# EAGLE design fresh_air_control (EAGLE 9.6.2)
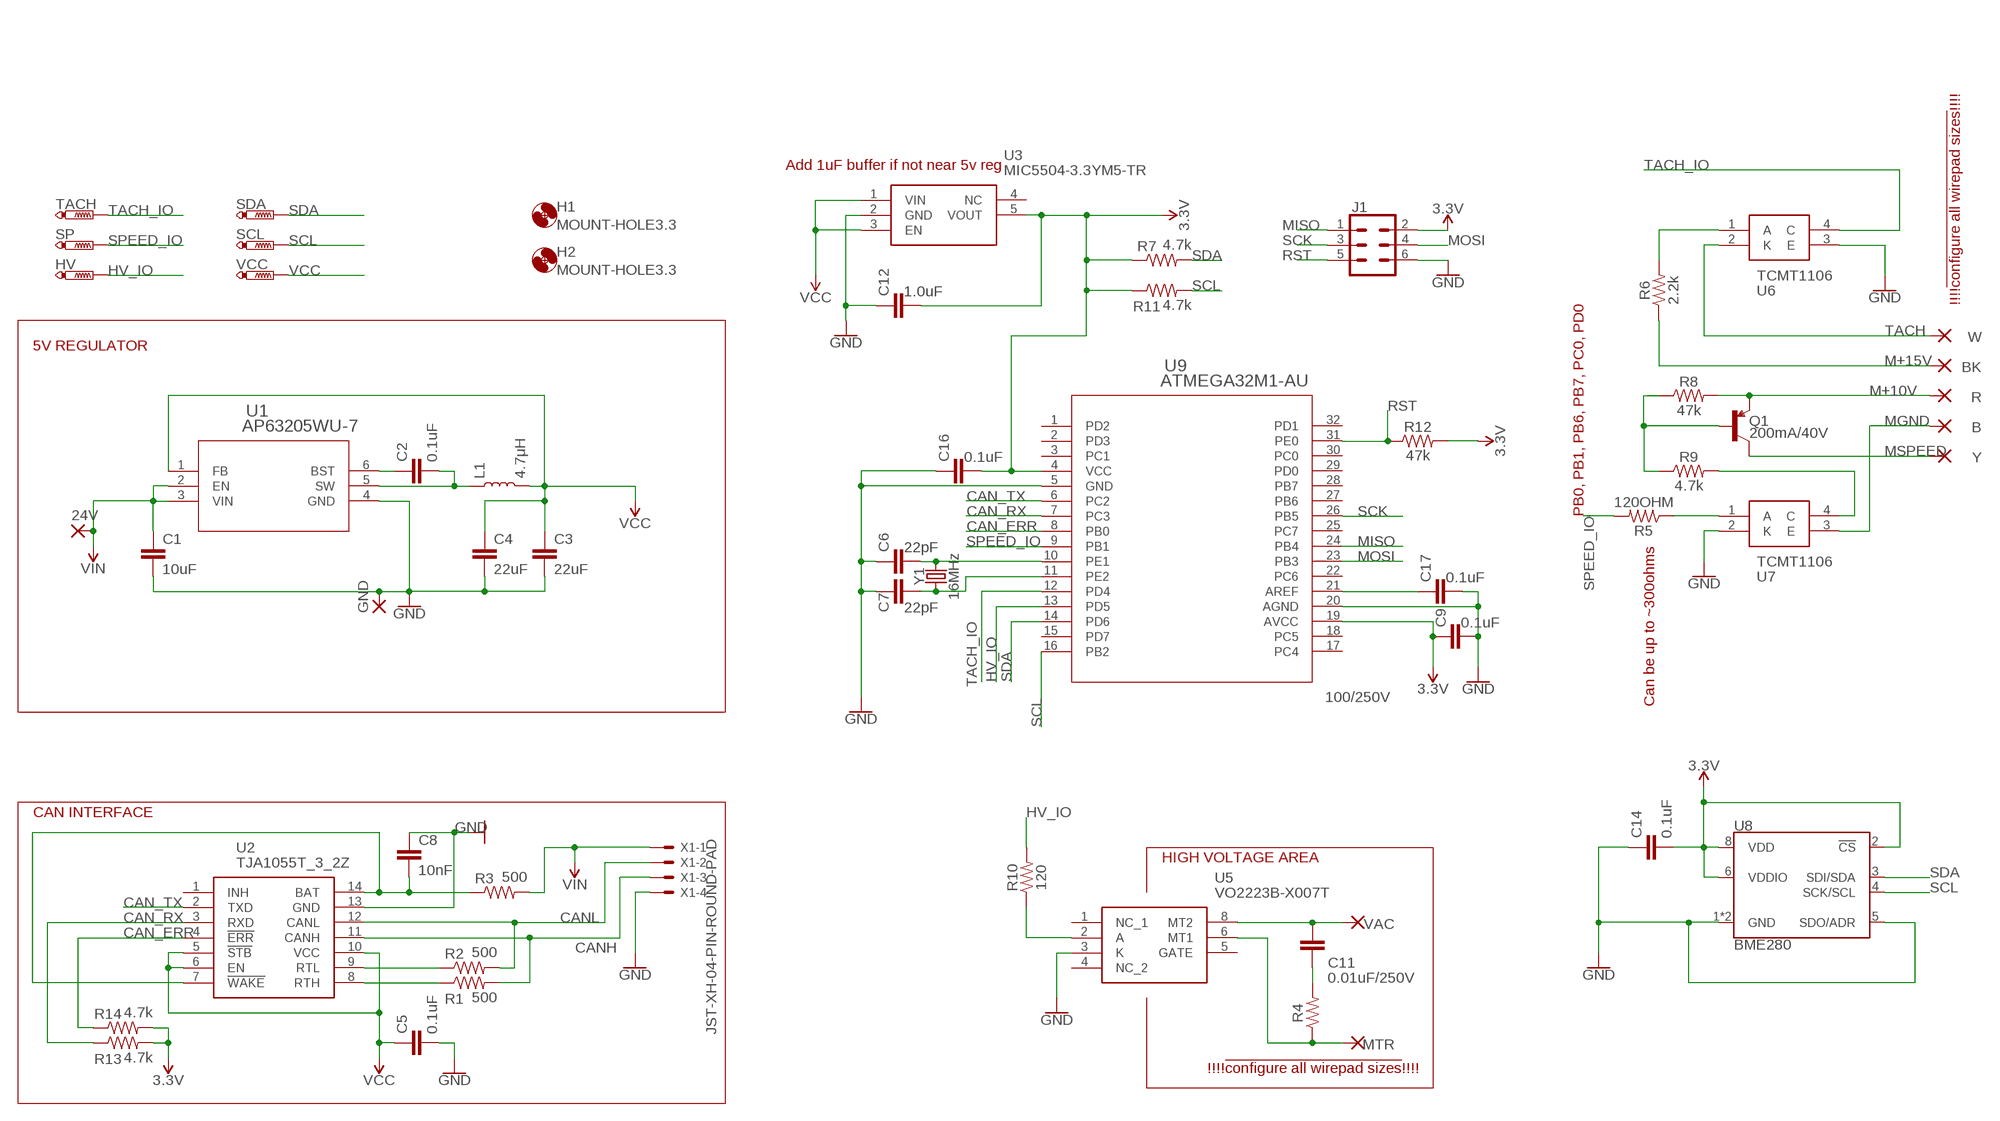
[diagram p0: schematic, sheet 1]

## Parts
24V  2,15/1,0  [2,15/1,0]
B  1,6/0,8  [1,6/0,8]
BK  1,6/0,8  [1,6/0,8]
C1  10uF  10UF-1210-50V-20%  [1210]
C2  0.1uF  0.1UF-0603-25V-5%  [0603]
C3  22uF  22UF-0805-6.3V-20%  [0805]
C4  22uF  22UF-0805-6.3V-20%  [0805]
C5  0.1uF  0.1UF-0603-25V-5%  [0603]
C6  22pF  22PF-0603-50V-5%  [0603]
C7  22pF  22PF-0603-50V-5%  [0603]
C8  10nF  10NF-0603-50V-10%  [0603]
C9  0.1uF  0.1UF-0603-25V-5%  [0603]
C11  0.01uF/250V  CAP-0805  [0805]
C12  1.0uF  1.0UF-0603-16V-10%  [0603]
C14  0.1uF  0.1UF-0603-25V-5%  [0603]
C16  0.1uF  0.1UF-0603-25V-5%  [0603]
C17  0.1uF  0.1UF-0603-25V-5%  [0603]
GND  2,15/1,0  [2,15/1,0]
H1  MOUNT-HOLE3.3  [3,3]
H2  MOUNT-HOLE3.3  [3,3]
HV  PTR1B1,27  [B1,27]
J1  CONN_03X2NO_SILK  [2X3-NS]
L1  4.7μH  4.7μH_SHIELDED_INDUCTORNPIS_LS  [INDUCTOR_4X4MM]
MTR  1,6/0,8  [1,6/0,8]
Q1  200mA/40V  TRANS_PNP-PMBT3906|MMBT3906L  [SOT23-3]
R  1,6/0,8  [1,6/0,8]
R1  500  RESISTOR0603  [0603]
R2  500  RESISTOR0603  [0603]
R3  500  RESISTOR0603  [0603]
R4  100/250V  RESISTOR0805  [0805]
R5  120OHM  [0603]
R6  2.2k  2.2KOHM-0603-1/10W-1%  [0603]
R7  4.7k  4.7KOHM-0603-1/10W-1%  [0603]
R8  47k  47KOHM-0603-1/10W-1%  [0603]
R9  4.7k  4.7KOHM-0603-1/10W-1%  [0603]
R10  120  120OHM  [0603]
R11  4.7k  4.7KOHM-0603-1/10W-1%  [0603]
R12  47k  47KOHM-0603-1/10W-1%  [0603]
R13  4.7k  4.7KOHM-0603-1/10W-1%  [0603]
R14  4.7k  4.7KOHM-0603-1/10W-1%  [0603]
SCL  PTR1B1,27  [B1,27]
SDA  PTR1B1,27  [B1,27]
SP  PTR1B1,27  [B1,27]
TACH  PTR1B1,27  [B1,27]
U1  AP63205WU-7  [SOIC_05WU-7_DIO]
U2  TJA1055T_3_2Z  [SOIC127P600X175-14N]
U3  MIC5504-3.3YM5-TR  [SOT95P280X145-5N]
U5  VO2223B-X007T  [VO2223BX007T]
U6  TCMT1106  [SOIC127P700X230-4N]
U7  TCMT1106  [SOIC127P700X230-4N]
U8  BME280  [LGA-8-2.5X2.5]
U9  ATMEGA32M1-AU  [32A_ATM]
VAC  1,6/0,8  [1,6/0,8]
VCC  PTR1B1,27  [B1,27]
W  1,6/0,8  [1,6/0,8]
X1  JST-XH-04-PIN-ROUND-PAD  [JST-XH-04-PACKAGE-ROUND-PAD]
Y  1,6/0,8  [1,6/0,8]
Y1  16MHz  CRYSTAL-16MHZSMD-5X3.2  [CRYSTAL-SMD-5X3.2-4PAD]

## Nets
3.3V: C9.1 C12.2 C14.2 C16.2 J1.2 R7.1 R11.1 R12.2 R13.2 R14.2 U3.5(VOUT) U8.2(!CS) U8.6(VDDIO) U8.8(VDD) U9.4(VCC) U9.19(AVCC)
CAN_ERR: R14.1 U2.4(!ERR) U9.8(PB0)
CAN_RX: R13.1 U2.3(RXD) U9.7(PC3)
CAN_TX: U2.2(TXD) U9.6(PC2)
CANH: R1.2 U2.11(CANH) X1.3
CANL: R2.2 U2.12(CANL) X1.2
GND: C1.2 C3.2 C4.2 C5.2 C6.1 C7.1 C8.1 C9.2 C12.1 C14.1 C16.1 C17.2 GND.1(P) J1.6 U1.4(GND) U2.13(GND) U3.2(GND) U5.3(K) U6.3(E) U7.2(K) U8.1(GND) U8.5(SDO/ADR) U8.7(GND) U9.5(GND) U9.20(AGND) X1.4
HV_IO: HV.TP R10.2 U9.13(PD5)
LINE: C11.1 U5.8(MT2) VAC.1(P)
LOAD: MTR.1(P) R4.1 U5.6(MT1)
M+10V: Q1.2(E) R8.2 R.1(P)
M+15V: BK.1(P) R6.1
MGND: B.1(P) U7.3(E)
MISO: J1.1 U9.24(PB4)
MOSI: J1.4 U9.23(PB3)
MSPEED: Q1.3(C) Y.1(P)
N$1: C2.2 L1.P$1 U1.5(SW)
N$2: C2.1 U1.6(BST)
N$3: C6.2 U9.10(PE1) Y1.3
N$4: C7.2 U9.11(PE2) Y1.1
N$5: R2.1 U2.9(RTL)
N$6: R1.1 U2.8(RTH)
N$8: C8.2 R3.1 U2.7(!WAKE) U2.14(BAT)
N$10: R6.2 U6.1(A)
N$11: C11.2 R4.2
N$12: R10.1 U5.2(A)
N$13: R5.1 U7.1(A)
N$15: Q1.1(B) R8.1 R9.1
N$16: R9.2 U7.4(C)
N$20: C17.1 U9.21(AREF)
RST: J1.5 R12.1 U9.31(PE0)
SCK: J1.3 U9.26(PB5)
SCL: R11.2 SCL.TP U8.4(SCK/SCL) U9.16(PB2)
SDA: R7.2 SDA.TP U8.3(SDI/SDA) U9.14(PD6)
SPEED_IO: R5.2 SP.TP U9.9(PB1)
TACH: U6.2(K) W.1(P)
TACH_IO: TACH.TP U6.4(C) U9.12(PD4)
VCC: C3.1 C4.1 C5.1 L1.P$2 U1.1(FB) U2.5(!STB) U2.6(EN) U2.10(VCC) U3.1(VIN) U3.3(EN) VCC.TP
VIN: 24V.1(P) C1.1 R3.2 U1.2(EN) U1.3(VIN) X1.1
Unconnected: U2.1(INH) U3.4(NC) U5.1(NC_1) U5.4(NC_2) U5.5(GATE) U9.1(PD2) U9.2(PD3) U9.3(PC1) U9.15(PD7) U9.17(PC4) U9.18(PC5) U9.22(PC6) U9.25(PC7) U9.27(PB6) U9.28(PB7) U9.29(PD0) U9.30(PC0) U9.32(PD1)

## Notes on the sheet
- Add 1uF buffer if not near 5v reg
- !!!!!configure all wirepad sizes!!!!!
- 5V REGULATOR
- PB0, PB1, PB6, PB7, PC0, PD0
- Can be up to ~300ohms
- CAN INTERFACE
- HIGH VOLTAGE AREA
- !!!!!configure all wirepad sizes!!!!!

## Library data of the parts
24V GND = wirepad:2,15/1,0: THROUGH-HOLE PAD
B BK MTR R VAC W Y = wirepad:1,6/0,8: THROUGH-HOLE PAD
C1 = SparkFun-Capacitors:10UF: 10.0µF ceramic capacitors A capacitor is a passive two-terminal electrical component used to store electrical energy temporarily in an electric field.; PROD_ID: CAP-09824
C2 C5 C9 C14 C16 C17 = SparkFun-Capacitors:0.1UF: 0.1µF ceramic capacitors A capacitor is a passive two-terminal electrical component used to store electrical energy temporarily in an electric field.; PROD_ID: CAP-08604
C3 C4 = SparkFun-Capacitors:22UF: 22µF ceramic capacitors A capacitor is a passive two-terminal electrical component used to store electrical energy temporarily in an electric field.; PROD_ID: CAP-08402
C6 C7 = SparkFun-Capacitors:22PF: 22pF ceramic capacitors A capacitor is a passive two-terminal electrical component used to store electrical energy temporarily in an electric field.; PROD_ID: CAP-07876
C8 = SparkFun-Capacitors:10NF: 0.01uF/10nF/10,000pF ceramic capacitors A capacitor is a passive two-terminal electrical component used to store electrical energy temporarily in an electric field. CAP-09321; PROD_ID: CAP-00867
C11 = SparkFun-Capacitors:CAP
C12 = SparkFun-Capacitors:1.0UF: 1µF ceramic capacitors A capacitor is a passive two-terminal electrical component used to store electrical energy temporarily in an electric field.; PROD_ID: CAP-00868
H1 H2 = holes:MOUNT-HOLE: MOUNTING HOLE with drill center marker
HV SCL SDA SP TACH VCC = testpad:PTR1: TEST PIN
J1 = SparkFun-Connectors:CONN_03X2: Multi connection point. Often used as Generic Header-pin footprint for 0.1 inch spaced/style header connections You can populate with any combo of single row headers, but if you'd like an exact match, check these: Header - 2x3 (Male, 0.1") <https://www.sparkfun.com/products/12807> (PRT-12807) Header - 2x3 (Female, 0.1") <https://www.sparkfun.com/products/13010> (PRT-13010) 2x3 Pin Shrouded Header <https://www.sparkfun.com/products/10877> (PRT-10877) On any of the 0.1 inch spaced packages, you can populate with these: Break Away Headers - Straight <https://www.sparkfun.com/products/116> (PRT-00116) Break Away Male Headers - Right Angle <https://www.sparkfun.com/products/553> (PRT-00553) Female Headers <https://www.sparkfun.com/products/115> (PRT-00115) Break Away Headers - Machine Pin <https://www.sparkfun.com/products/117> (PRT-00117) Break Away Female Headers - Swiss Machine Pin <https://www.sparkfun.com/products/743> (PRT-00743) Special note: the shrouded connector mates well with our 3x2 ribbon cables: Ribbon Crimp Connector - 6-pin (2x3, Female) <https://www.sparkfun.com/products/10651> (PRT-10651) Ribbon Cable - 6 wire (15ft) <https://www.sparkfun.com/products/10646> (PRT-10646)
L1 = SparkFun-Coils:4.7μH_SHIELDED_INDUCTOR: 4.7uH Inductor 4.7uH 1.4A 50mOhm 1008(2520) Package Shielded; PROD_ID: NDUC-15245
Q1 = SparkFun-DiscreteSemi:TRANS_PNP: PNP transistor Current controlled devices typically used to amplify current or used as a switch. SparkFun Products: SparkFun Serial Enabled 16x2 LCD - Red on Black <https://www.sparkfun.com/products/9068> SparkFun Logomatic <https://www.sparkfun.com/products/12772>; PROD_ID: TRANS-08052
R1-R4 = SparkFun-Resistors:RESISTOR: Generic Resistor Package
R5 R10 = SparkFun-Resistors:120OHM: 120Ω resistor A resistor is a passive two-terminal electrical component that implements electrical resistance as a circuit element. Resistors act to reduce current flow, and, at the same time, act to lower voltage levels within circuits. - Wikipedia
R6 = SparkFun-Resistors:2.2KOHM: 2.2kΩ resistor A resistor is a passive two-terminal electrical component that implements electrical resistance as a circuit element. Resistors act to reduce current flow, and, at the same time, act to lower voltage levels within circuits. - Wikipedia; PROD_ID: RES-08272
R7 R9 R11 R13 R14 = SparkFun-Resistors:4.7KOHM: 4.7kΩ resistor A resistor is a passive two-terminal electrical component that implements electrical resistance as a circuit element. Resistors act to reduce current flow, and, at the same time, act to lower voltage levels within circuits. - Wikipedia; PROD_ID: RES-07857
R8 R12 = SparkFun-Resistors:47KOHM: 47kΩ resistor A resistor is a passive two-terminal electrical component that implements electrical resistance as a circuit element. Resistors act to reduce current flow, and, at the same time, act to lower voltage levels within circuits. - Wikipedia; PROD_ID: RES-07871
U1 = Diodes buck converter:AP63205WU-7; COPYRIGHT: Copyright (C) 2023 Ultra Librarian. All rights reserved.; MANUFACTURER_PART_NUMBER: AP63205WU-7; MFR_NAME: Diodes Inc
U2 = TJA1055T_3_2Z:TJA1055T_3_2Z: CAN Interface IC Enhanced fault-tolerant CAN transceiver Source: Datasheet <http://www.nxp.com/docs/en/data-sheet/TJA1055.pdf>; DESCRIPTION: CAN Interface IC Enhanced fault-tolerant CAN transceiver; HEIGHT: 1.75mm; MANUFACTURER_NAME: NXP; MANUFACTURER_PART_NUMBER: TJA1055T/3/2Z; MOUSER_PART_NUMBER: 771-TJA1055T/3/2Z; MOUSER_PRICE-STOCK: https://www.mouser.co.uk/ProductDetail/NXP-Semiconductors/TJA1055T-3-2Z?qs=qSfuJ%252Bfl%2Fd73Y%2FIsMw3Ayg%3D%3D
U3 = MIC5504-3.3YM5-TR:MIC5504-3.3YM5-TR: MICROCHIP - MIC5504-3.3YM5-TR - LDO VOLT REG, 0.3A, 3.3V, SOT-23-5 Source: Datasheet <https://componentsearchengine.com/Datasheets/2/MIC5504-3.3YM5-TR.pdf>; DESCRIPTION: MICROCHIP - MIC5504-3.3YM5-TR - LDO VOLT REG, 0.3A, 3.3V, SOT-23-5; HEIGHT: 1.45mm; MANUFACTURER_NAME: Microchip; MANUFACTURER_PART_NUMBER: MIC5504-3.3YM5-TR; MOUSER_PART_NUMBER: 998-MIC5504-3.3YM5TR; MOUSER_PRICE-STOCK: https://www.mouser.co.uk/ProductDetail/Microchip-Technology/MIC5504-3.3YM5-TR?qs=U6T8BxXiZAUmVQ5Zs217qQ%3D%3D
U5 = VO2223B-X007T:VO2223B-X007T: Triac & SCR Output Optocouplers 1A, 600V PhotoTRIAC SMD-8, UL, cUL Source: Datasheet <https://www.vishay.com/docs/83312/vo2223b.pdf>; DESCRIPTION: Triac & SCR Output Optocouplers 1A, 600V PhotoTRIAC SMD-8, UL, cUL; HEIGHT: 4.6mm; MANUFACTURER_NAME: Vishay; MANUFACTURER_PART_NUMBER: VO2223B-X007T; MOUSER_PART_NUMBER: 78-VO2223B-X007T; MOUSER_PRICE-STOCK: https://www.mouser.co.uk/ProductDetail/Vishay-Semiconductors/VO2223B-X007T?qs=r5DSvlrkXmLdAybzHjTr7g%3D%3D
U6 U7 = TCMT1106:TCMT1106: Optocoupler Transistor O/P 1-CH Source: Datasheet <https://www.vishay.com/docs/83510/tcmt1100.pdf>; DESCRIPTION: Optocoupler Transistor O/P 1-CH; HEIGHT: 2.3mm; MANUFACTURER_NAME: Vishay; MANUFACTURER_PART_NUMBER: TCMT1106; MOUSER_PART_NUMBER: 782-TCMT1106; MOUSER_PRICE-STOCK: https://www.mouser.co.uk/ProductDetail/Vishay-Semiconductors/TCMT1106?qs=iFB%2FIts7N%252BA3ecLP71cKjQ%3D%3D
U8 = SparkFun-Sensors:BME280: Bosch BME280 – Combined Humidity and Pressure Sensor The BME280 is as combined digital humidity, pressure and temperature sensor based on proven sensing principles. The sensor module is housed in an extremely compact metal-lid LGA package with a footprint of only 2.5×2.5mm² with a height of 0.93mm. Its small dimensions and its low power consumption allow the implementation in battery driven devices such as handsets, GPS modules or watches. Datasheet <https://cdn.sparkfun.com/assets/learn_tutorials/4/1/9/BST-BME280_DS001-10.pdf> SparkFun Products SparkFun Atmospheric Sensor Breakout - BME280 <https://www.sparkfun.com/products/13676> (SEN-13676); PROD_ID: IC-13090
U9 = ATMEGA31M1-AU:ATMEGA32M1-AU; COPYRIGHT: Copyright (C) 2023 Ultra Librarian. All rights reserved.; MANUFACTURER_PART_NUMBER: ATMEGA32M1-AU; MFR_NAME: Microchip
X1 = Rembrandt Electronics - JST XH Connectors v1-0:JST-XH-04-PIN: JST XH Connector 2 Pin Wire to board connector. Pitch: 2,54 mm, (0.100") Number of pins: 4 Created by Rembrandt Electronics www.rembrandtelectronics.com
Y1 = SparkFun-Clocks:CRYSTAL-16MHZ: 16MHz Crystal Digikey Example <http://www.digikey.com/product-search/en?keywords=535-9122-1-ND> Frequency: 16MHz Frequency Stability: ±50ppm Frequency Tolerance: ±20ppm Load Capacitance: 18pF SparkFun Products: Pro Micro -5V/16MHz <https://www.sparkfun.com/products/12640> SparkFun Serial Enabled LCD Kit <https://www.sparkfun.com/products/10097>; PROD_ID: XTAL-08218; SF_ID: COM-00094

## Board
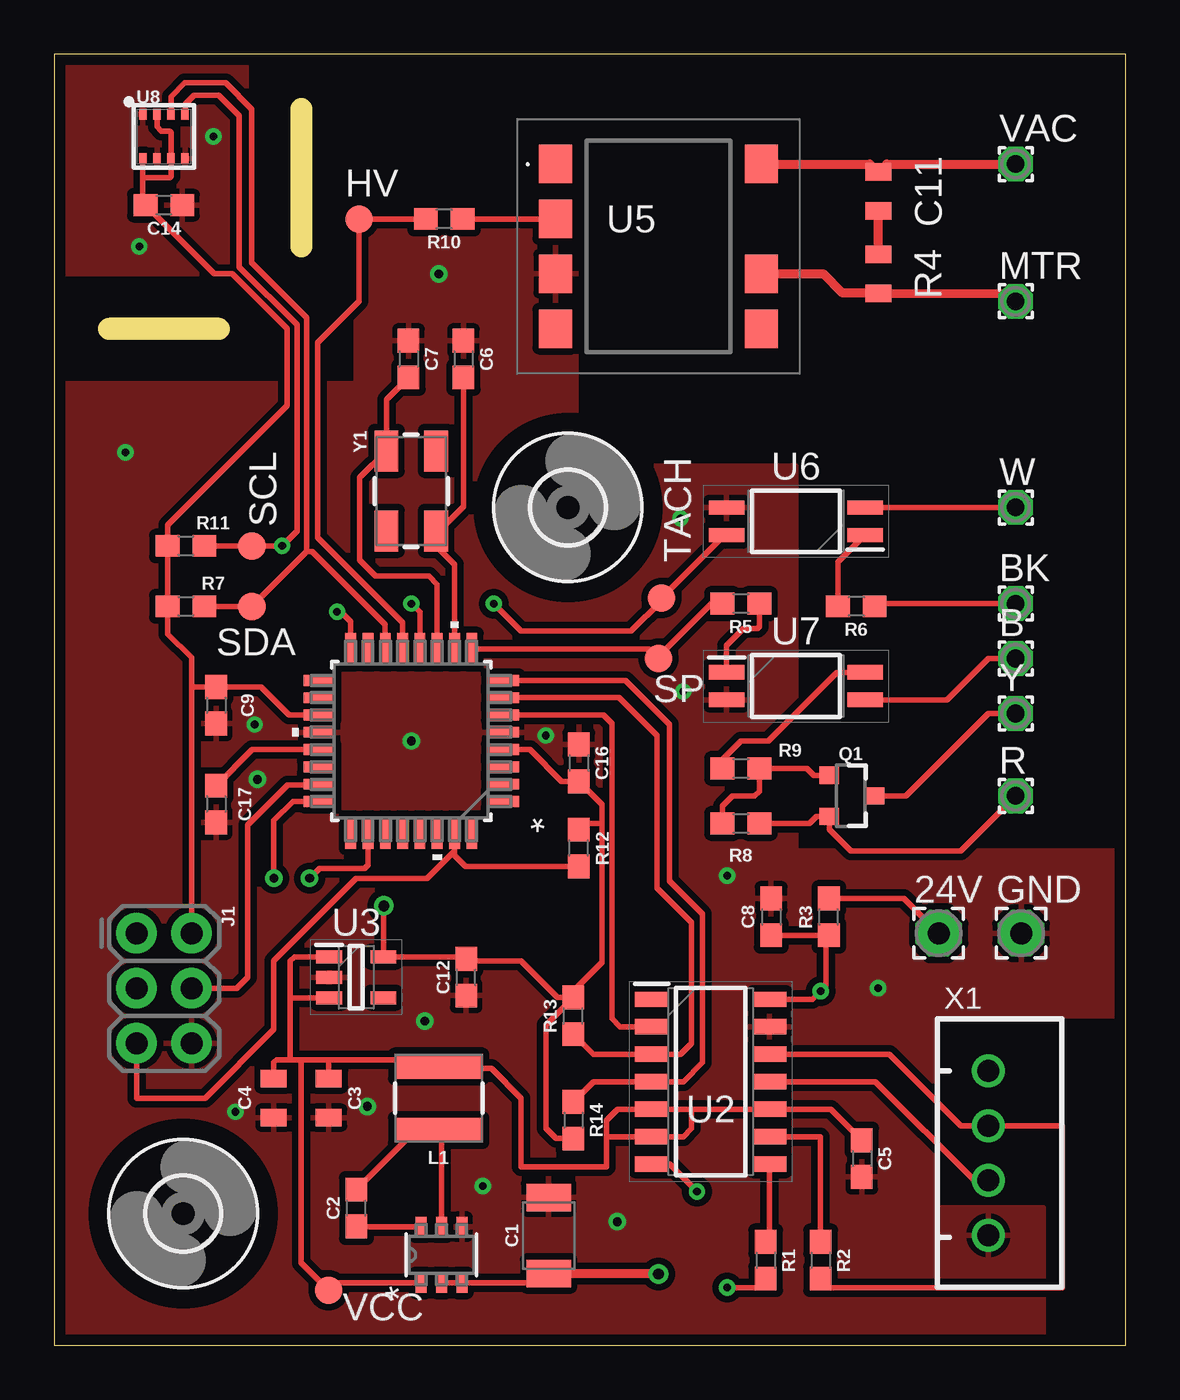
[diagram p1: board, top side]
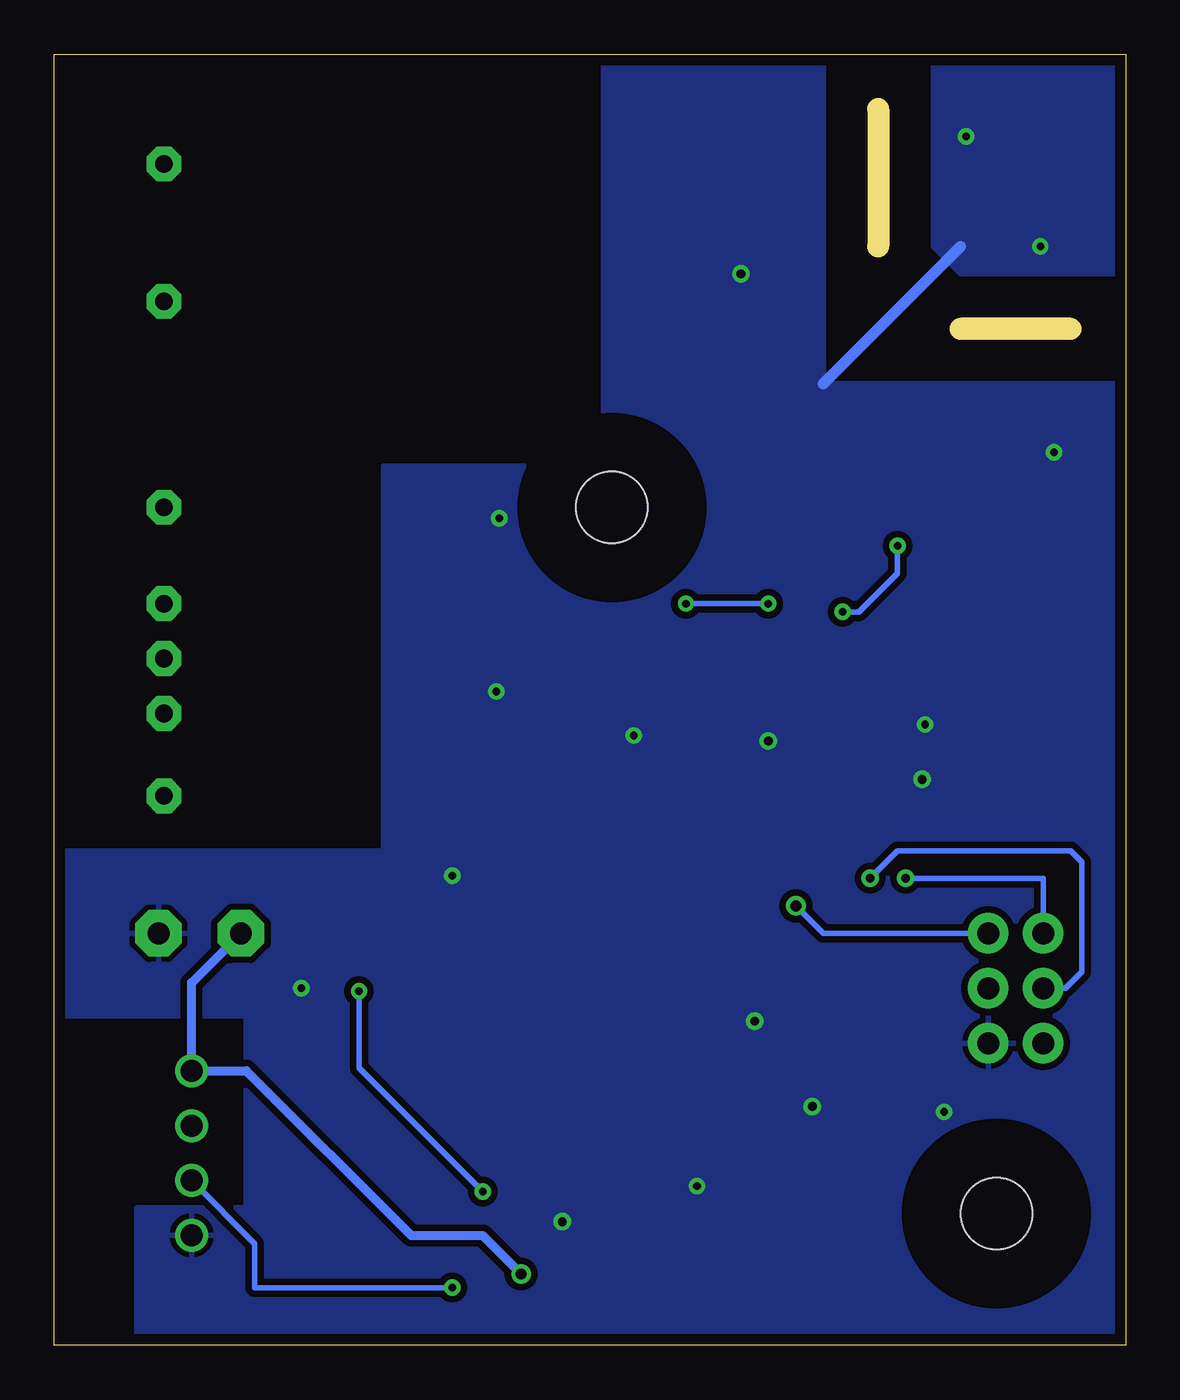
[diagram p2: board, bottom side, seen from below]

Size 49.53 x 59.69 mm. Coordinates in mm from the lower left corner, seen from the top.
Outline: 2.54,46.99 7.62,46.99
Outline: 11.43,57.15 11.43,50.8
Outline: 0,0 49.53,0 49.53,59.69 0,59.69 0,0
Copper layers (1*16): Top 0.035mm / dielectric 1.6mm / Bottom 0.035mm
Design rules "Elecrow_2-layer_PCB_eagle_rule_conservative": minimum track width 8mil, minimum drill 12mil, track to track 8mil, track to pad 6mil, pad to pad 6mil, via to via 8mil, smd to smd 0mil, copper to edge 20mil, drill to drill 10mil, minimum pad ring 8mil, minimum via ring 8mil, stop-mask expansion 0mil, vias tented up to drill 100mil, thermal gap 10mil
Milling: 2 lines

### Footprints (pad centres in the part's own frame; a part is rotated, then mirrored left to right if it is on the bottom)
2,15/1,0 = drill 1.016 pad 2.159 octagon: 1 0,0
1,6/0,8 = drill 0.813 pad 1.6 octagon: 1 0,0
1210 = smd 1.27 x 2.06: 1 -1.755,0; 2 1.755,0
0603 = smd 1.1 x 1: 1 -0.85,0; 2 0.85,0
0805 = smd 0.8 x 1.2: 1 -0.9,0; 2 0.9,0
3,3 = hole 3.3: 0,0
B1,27 = smd 1.27 x 1.27: TP 0,0
2X3-NS = drill 1.016 pad 1.88: 1 -2.54,-1.27; 2 -2.54,1.27; 3 0,-1.27; 4 0,1.27; 5 2.54,-1.27; 6 2.54,1.27
INDUCTOR_4X4MM = smd 4.089 x 1.143: P$1 0,1.473; P$2 0,-1.473
SOT23-3 = smd 0.8 x 0.9: 1 -0.95,-1; 2 0.95,-1; 3 0,1.1
SOIC_05WU-7_DIO = smd 0.902 x 0.508: 1 -1.302,0.95; 2 -1.302,0; 3 -1.302,-0.95; 4 1.302,-0.95; 5 1.302,0; 6 1.302,0.95
SOIC127P600X175-14N = smd 1.55 x 0.7: 1 -2.725,3.81; 2 -2.725,2.54; 3 -2.725,1.27; 4 -2.725,0; 5 -2.725,-1.27; 6 -2.725,-2.54; 7 -2.725,-3.81; 8 2.725,-3.81; 9 2.725,-2.54; 10 2.725,-1.27; 11 2.725,0; 12 2.725,1.27; 13 2.725,2.54; 14 2.725,3.81
SOT95P280X145-5N = smd 1.2 x 0.6: 1 -1.25,0.95; 2 -1.25,0; 3 -1.25,-0.95; 4 1.25,-0.95; 5 1.25,0.95
VO2223BX007T = smd 1.525 x 1.78: 1 -4.762,3.81; 2 -4.762,1.27; 3 -4.762,-1.27; 4 -4.762,-3.81; 5 4.763,-3.81; 6 4.763,-1.27; 8 4.763,3.81
SOIC127P700X230-4N = smd 1.65 x 0.65: 1 -3.2,0.635; 2 -3.2,-0.635; 3 3.2,-0.635; 4 3.2,0.635
LGA-8-2.5X2.5 = smd 0.35 x 0.5: 1 -0.975,1.025; 2 -0.325,1.025; 3 0.325,1.025; 4 0.975,1.025; 5 0.975,-1.025; 6 0.325,-1.025; 7 -0.325,-1.025; 8 -0.975,-1.025
32A_ATM = smd 1.461 x 0.501: 1 -4.25,2.8; 2 -4.25,2; 3 -4.25,1.2; 4 -4.25,0.4; 5 -4.25,-0.4; 6 -4.25,-1.2; 7 -4.25,-2; 8 -4.25,-2.8; 17 4.25,-2.8; 18 4.25,-2; 19 4.25,-1.2; 20 4.25,-0.4; 21 4.25,0.4; 22 4.25,1.2; 23 4.25,2; 24 4.25,2.8 | smd 0.501 x 1.461: 9 -2.8,-4.25; 10 -2,-4.25; 11 -1.2,-4.25; 12 -0.4,-4.25; 13 0.4,-4.25; 14 1.2,-4.25; 15 2,-4.25; 16 2.8,-4.25; 25 2.8,4.25; 26 2,4.25; 27 1.2,4.25; 28 0.4,4.25; 29 -0.4,4.25; 30 -1.2,4.25; 31 -2,4.25; 32 -2.8,4.25
JST-XH-04-PACKAGE-ROUND-PAD = drill 1.016: 1 -3.81,0; 2 -1.27,0; 3 1.27,0; 4 3.81,0
CRYSTAL-SMD-5X3.2-4PAD = smd 1.9 x 1.1: 1 -1.85,-1.15; 2 1.85,-1.15; 3 1.85,1.15; 4 -1.85,1.15

### Placement (x,y rotation side)
24V  40.89,19.05 0 top
B  44.45,31.75 0 top
BK  44.45,34.29 0 top
C1  22.86,5.08 90 top
C2  13.97,6.35 90 top
C3  12.7,11.43 270 top
C4  10.16,11.43 270 top
C5  37.34,8.64 270 top
C6  18.92,45.59 270 top
C7  16.38,45.59 270 top
C8  33.15,19.81 270 top
C9  7.49,29.59 270 top
C11  38.1,53.34 270 top
C12  19.05,17.02 90 top
C14  5.08,52.7 180 top
C16  24.26,26.92 270 top
C17  7.49,25.02 270 top
GND  44.7,19.05 0 top
H1  5.97,6.1 0 top
H2  23.75,38.73 0 top
HV  14.1,52.07 0 top
J1  5.08,16.51 270 top
L1  17.78,11.43 180 top
MTR  44.45,48.26 0 top
Q1  36.83,25.4 270 top
R  44.45,25.4 0 top
R1  32.89,3.94 270 top
R2  35.43,3.94 270 top
R3  35.81,19.81 90 top
R4  38.1,49.53 90 top
R5  31.75,34.29 180 top
R6  37.08,34.16 180 top
R7  6.1,34.16 0 top
R8  31.75,24.13 0 top
R9  31.75,26.67 180 top
R10  18.03,52.07 180 top
R11  6.1,36.96 0 top
R12  24.26,22.99 90 top
R13  24,15.24 90 top
R14  24,10.41 270 top
SCL  9.14,36.96 0 top
SDA  9.14,34.16 0 top
SP  27.94,31.75 0 top
TACH  28.07,34.54 0 top
U1  17.91,4.19 90 top
U2  30.35,12.19 0 top
U3  13.97,17.02 0 top
U5  27.94,50.8 0 top
U6  34.29,38.1 180 top
U7  34.29,30.48 0 top
U8  5.08,55.88 0 top
U9  16.51,27.94 180 top
VAC  44.45,54.61 0 top
VCC  12.7,2.54 0 top
W  44.45,38.73 0 top
X1  43.18,8.89 270 top
Y  44.45,29.21 0 top
Y1  16.51,39.5 270 top

### Tracks (layer width: path | path; a pad name or v marks a point on that pad's centre or on a via)
3.3V  (via drill 0.5)
  Top 0.254: U8.8 4.11,53.98 | 4.11,53.98 4.11,52.83 C14.2 7.41,49.53 8.23,49.53 10.77,46.99 10.77,43.44 5.25,37.92 R11.1 R7.1 5.25,32.89 6.35,31.79 6.35,30.44 | 4.11,53.98 5.33,53.98 5.41,54.05 U8.6 5.41,56.06 5.33,56.13 4.95,56.13 4.75,56.33 U8.2 | R13.2 22.73,14.82 22.73,10.03 23.2,9.56 R14.2 | R13.2 23.28,16.09 21.59,17.78 19.14,17.78 C12.2 18.95,17.97 U3.5 15.24,17.99 v15.24,20.32 | R13.2 24,16.38 25.32,17.7 25.32,24.13 | 25.32,24.13 25.32,25.01 C16.2 24.13,26.07 23.46,26.07 21.99,27.54 U9.4 | R12.2 24.55,24.13 25.32,24.13 | U9.19 10.87,29.14 9.56,30.44 C9.1 6.35,30.44 | 6.35,30.44 J1.2
  Bottom 0.254: J1.2 13.97,19.05 v15.24,20.32
CAN_ERR
  Top 0.254: U9.8 26.41,30.74 28.45,28.7 28.45,21.46 29.97,19.94 29.97,13.08 29.08,12.19 U2.4 24.93,12.19 R14.1
CAN_RX
  Top 0.254: U9.7 26.12,29.94 27.86,28.19 27.86,21.15 29.46,19.55 29.46,13.97 28.96,13.46 U2.3 24.93,13.46 R13.1
CAN_TX
  Top 0.254: U2.2 26.16,14.73 25.78,15.11 25.78,28.76 25.4,29.14 U9.6
CANH  (via drill 0.35)
  Top 0.254: X1.3 42.55,7.62 37.97,12.19 U2.11 | R1.2 32.47,2.67 v31.11,2.67
  Bottom 0.254: v31.11,2.67 40.26,2.67 40.26,4.7 X1.3
CANL
  Top 0.254: U2.12 38.61,13.46 41.91,10.16 X1.2 46.61,10.16 46.61,2.67 35.85,2.67 R2.2
GND  (via drill 0.35, 0.4)
  Bottom 0.508: 7.62,50.8 13.97,44.45
  other vias: 3.94,50.8 7.37,55.88 14.48,11.05 9.4,26.16 17.14,14.99 26.04,5.71 16.51,27.94 17.78,49.53 3.3,41.27 9.27,28.7 22.73,28.19 29.08,30.23 28.96,38.23 31.11,21.72 38.1,16.51 8.38,10.79 19.81,7.37
  pour Top (isolate 0.305): 0,59.69 8.89,59.69 8.89,50.67 7.75,49.53 0,49.53
  pour Bottom (isolate 0.305): 0,59.69 0,49.53 7.62,49.53 8.89,50.8 8.89,59.69
  pour Bottom (isolate 0.305): 0,44.45 13.97,44.45 13.97,59.69 24.13,59.69 24.13,40.64 34.29,40.64 34.29,22.86 49.53,22.86 49.53,15.24 40.64,15.24 40.64,6.35 45.72,6.35 45.72,0 0,0
  pour Top (isolate 0.305): 0,44.45 13.97,44.45 13.97,59.69 24.13,59.69 24.13,40.64 34.29,40.64 34.29,22.86 49.53,22.86 49.53,15.24 40.64,15.24 40.64,6.35 45.72,6.35 45.72,0 0,0
HV_IO
  Top 0.254: R10.2 HV.TP 14.1,48.26 12.19,46.35 12.19,37.34 16.11,33.42 U9.13
LINE
  Top 0.406: U5.8 37.7,54.61 C11.1 38.49,54.61 VAC.1
LOAD
  Top 0.406: U5.6 35.56,49.53 36.45,48.64 38.07,48.64 R4.1 44.1,48.61 MTR.1
M+10V
  Top 0.254: R8.2 34.92,24.13 35.24,24.45 Q1.2 35.83,23.86 36.83,22.86 41.91,22.86 R.1
M+15V
  Top 0.254: R6.1 38.06,34.29 BK.1
MGND
  Top 0.254: U7.3 41.27,29.84 43.18,31.75 B.1
MISO  (via drill 0.4)
  Top 0.254: U9.24 11.04,25.14 10.16,24.26 v10.16,21.59
  Bottom 0.254: v10.16,21.59 3.81,21.59 J1.1
MOSI
  Top 0.254: U9.23 12.23,25.91 10.79,25.91 8.94,24.05 8.94,17.02 8.43,16.51 J1.4
MSPEED
  Top 0.254: Q1.3 39.37,25.4 43.18,29.21 Y.1
N$1
  Top 0.254: U1.5 17.91,9.83 L1.P$1 16.73,9.96 C2.2
N$2
  Top 0.254: C2.1 U1.6
N$3
  Top 0.254: U9.10 18.51,36.1 17.78,36.83 17.78,37.65 | Y1.3 17.78,37.65 | 17.78,37.65 17.79,37.65 18.92,38.78 C6.2
N$4
  Top 0.254: U9.11 17.71,35.18 17.33,35.56 14.86,35.56 14.12,36.3 14.12,40.11 Y1.1 15.36,43.72 C7.2
N$5
  Top 0.254: U2.9 35.43,9.65 R2.1
N$6
  Top 0.254: R1.1 33.08,4.75 U2.8
N$8  (via drill 0.35)
  Top 0.254: U2.14 35.05,16 v35.43,16.38 35.69,16.64 35.69,18.84 R3.1 C8.2 | v29.72,7.11 28.45,8.38 U2.7
  Bottom 0.254: v29.72,7.11 35.43,12.83 v35.43,16.38
N$10
  Top 0.254: U6.1 36.23,36.21 R6.2
N$11
  Top 0.406: R4.2 C11.2
N$12
  Top 0.254: U5.2 R10.1
N$13
  Top 0.254: U7.1 31.09,32.36 31.88,33.15 32.51,33.15 32.6,33.23 R5.1
N$15
  Top 0.254: R8.1 30.9,24.93 31.37,25.4 32.38,25.4 32.6,25.61 R9.1 34.8,26.67 35.12,26.35 Q1.1
N$16
  Top 0.254: U7.4 36.2,31.11 33.02,27.94 31.75,27.94 30.9,27.09 R9.2
N$20
  Top 0.254: C17.1 9.16,27.54 U9.21
RST
  Top 0.254: R12.1 19.01,22.14 18.51,22.64 18.51,22.86 | 18.51,22.86 U9.31 | 18.51,22.86 17.24,21.59 13.97,21.59 10.16,17.78 10.16,14.61 6.99,11.43 3.81,11.43 J1.5
SCK  (via drill 0.4)
  Top 0.254: U9.26 14.51,22.21 14.35,22.05 12.27,22.05 v11.81,21.59
  Bottom 0.254: v11.81,21.59 10.54,22.86 2.54,22.86 2.03,22.35 2.03,17.27 2.79,16.51 J1.3
SCL  (via drill 0.35)
  Top 0.254: R11.2 SCL.TP v10.54,36.96 11.23,37.64 11.23,47.18 8.56,49.85 8.56,56.83 7.61,57.78 6.48,57.78 6.05,57.36 U8.4 | v13.08,33.91 13.26,33.91 13.71,33.46 U9.16
  Bottom 0.254: v13.08,33.91 12.32,33.91 10.54,35.69 v10.54,36.96
SDA
  Top 0.254: U8.3 5.41,57.73 6.04,58.37 7.92,58.37 9.14,57.15 9.14,50.04 11.68,47.5 11.68,36.7 | 11.68,36.7 SDA.TP R7.2 | U9.14 15.31,33.33 11.94,36.7 11.68,36.7
SPEED_IO
  Top 0.254: U9.9 27.5,32.19 SP.TP 27.94,31.84 30.39,34.29 R5.2
TACH
  Top 0.254: U6.2 W.1
TACH_IO  (via drill 0.35)
  Top 0.254: v16.51,34.29 16.91,33.89 U9.12 | v20.32,34.29 21.59,33.02 26.67,33.02 28.07,34.42 TACH.TP 30.96,37.44 31.09,37.44 U6.4
  Bottom 0.254: v16.51,34.29 v20.32,34.29
VCC
  Top 0.254: C5.1 35.9,10.92 U2.10 29.46,10.92 | 29.46,10.92 U2.5 26.04,10.92 25.53,10.41 25.53,9.65 | 12.7,13.21 C3.1 | 12.7,13.21 17.48,13.21 L1.P$2 17.88,12.8 20.22,12.8 21.59,11.43 21.59,8.26 25.53,8.26 25.53,9.65 | C4.1 10.16,13.08 10.29,13.21 10.92,13.21 | 10.92,13.21 11.43,13.21 | 11.43,13.21 12.7,13.21 | 11.43,13.21 11.43,3.81 VCC.TP 13.05,2.89 U1.1 | 10.92,13.21 10.92,16 | 10.92,16 10.92,17.78 11.11,17.97 U3.1 | 25.53,9.65 U2.6 29.08,9.65 29.46,10.03 29.46,10.92 | U3.3 10.99,16.07 10.92,16
VIN  (via drill 0.5)
  Top 0.254: U1.2 U1.3 22.47,2.89 22.88,3.3 | R3.2 39.28,20.66 24V.1
  Top 0.406: v27.94,3.3 22.88,3.3 C1.1
  Bottom 0.406: 24V.1 43.18,16.76 X1.1 40.64,12.7 33.02,5.08 29.72,5.08 v27.94,3.3